# EAGLE design I2C_motor_driver (EAGLE 9.1.3)
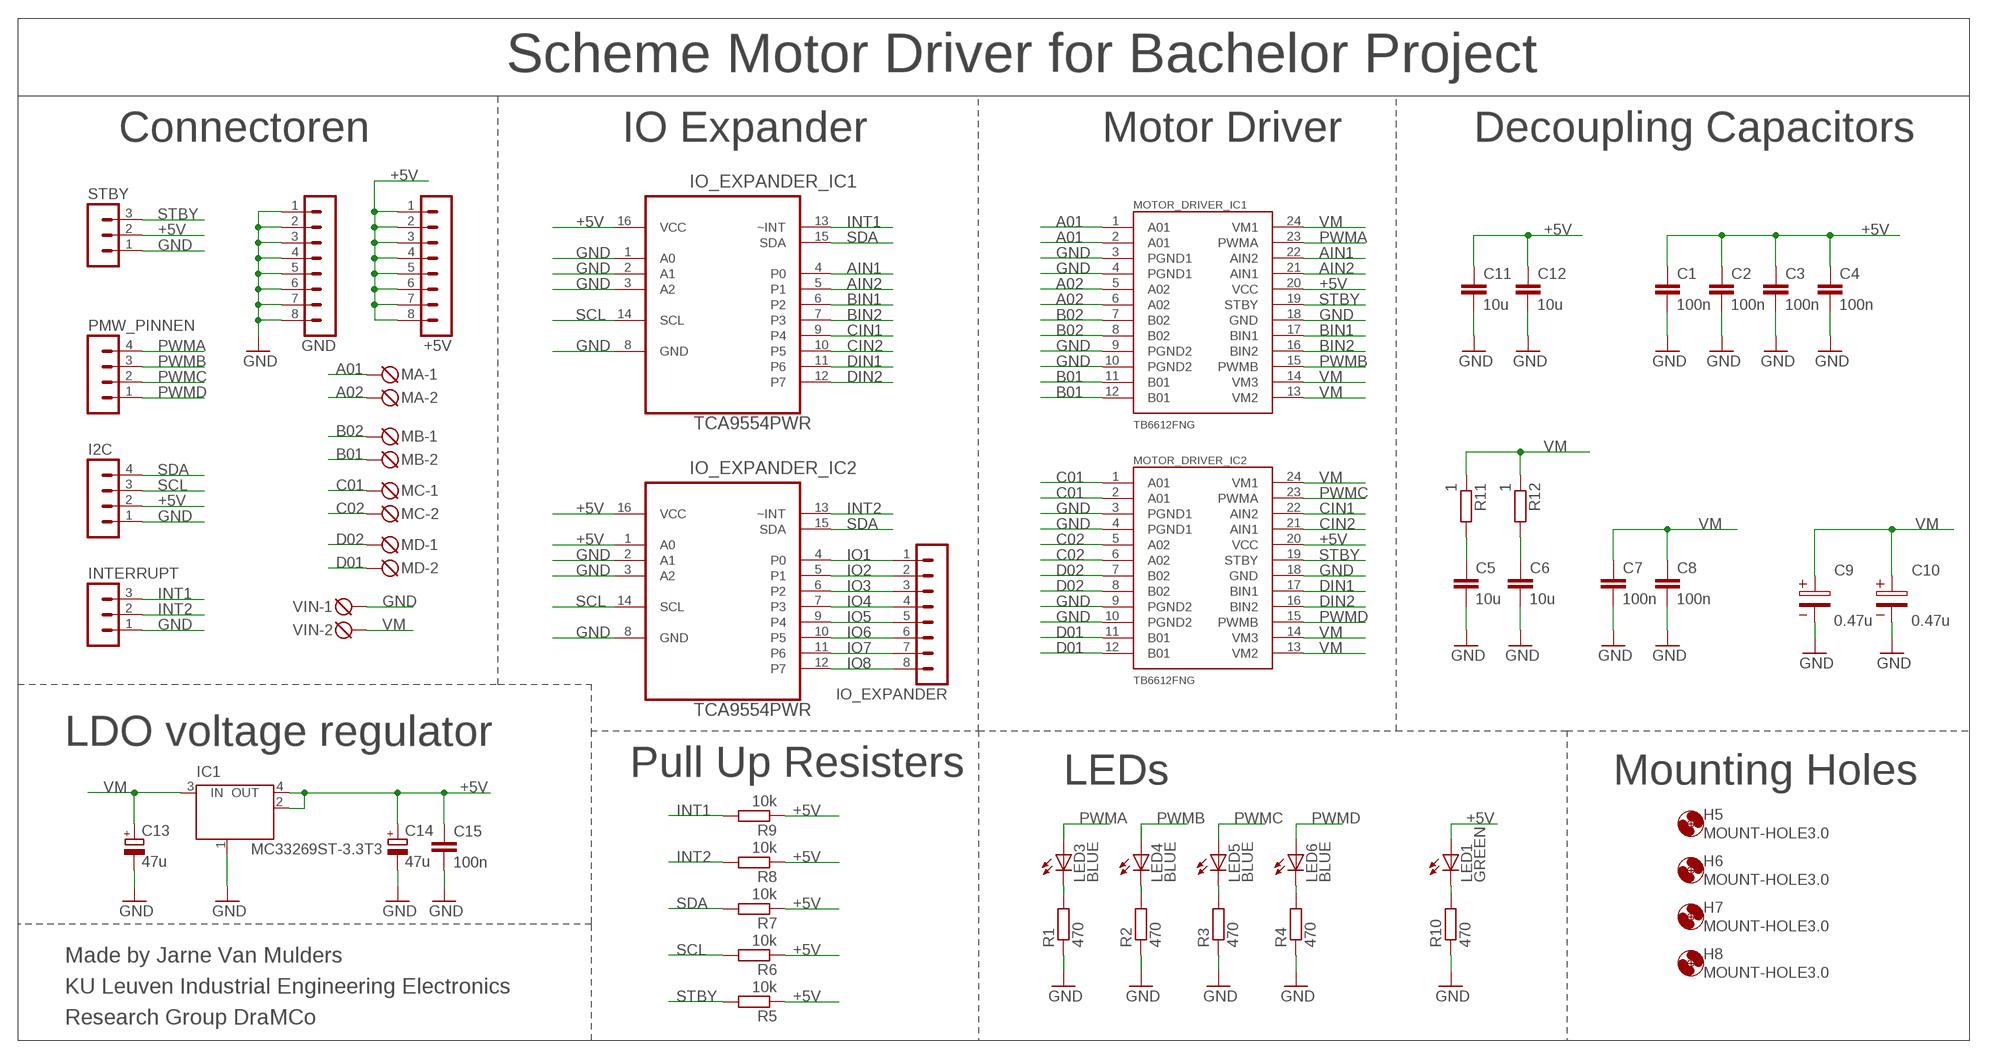
[diagram p0: schematic, sheet 1]

## Parts
+5V  MA08-1  [MA08-1]
C1  100n  C-EUC1206K  [C1206K]
C2  100n  C-EUC1206K  [C1206K]
C3  100n  C-EUC1206K  [C1206K]
C4  100n  C-EUC1206K  [C1206K]
C5  10u  C-EUC1206K  [C1206K]
C6  10u  C-EUC1206K  [C1206K]
C7  100n  C-EUC1206K  [C1206K]
C8  100n  C-EUC1206K  [C1206K]
C9  0.47u  WCAP-ASLI_4X5,5_865080740002  [2.6X1.6X1(BXCXA)]
C10  0.47u  WCAP-ASLI_4X5,5_865080740002  [2.6X1.6X1(BXCXA)]
C11  10u  C-EUC1206K  [C1206K]
C12  10u  C-EUC1206K  [C1206K]
C13  47u  CPOL-EUD  [PANASONIC_D]
C14  47u  CPOL-EUD  [PANASONIC_D]
C15  100n  C-EUC1206K  [C1206K]
GND  MA08-1  [MA08-1]
H5  MOUNT-HOLE3.0  [3,0]
H6  MOUNT-HOLE3.0  [3,0]
H7  MOUNT-HOLE3.0  [3,0]
H8  MOUNT-HOLE3.0  [3,0]
I2C  MA04-1  [MA04-1]
IC1  MC33269ST-3.3T3  [SOT223]
INTERRUPT  MA03-1  [MA03-1]
IO_EXPANDER  MA08-1  [MA08-1]
IO_EXPANDER_IC1  TCA9554PWR  [SOP65P640X120-16N]
IO_EXPANDER_IC2  TCA9554PWR  [SOP65P640X120-16N]
LED1  GREEN  LEDSML0805  [SML0805]
LED3  BLUE  LEDSML0805  [SML0805]
LED4  BLUE  LEDSML0805  [SML0805]
LED5  BLUE  LEDSML0805  [SML0805]
LED6  BLUE  LEDSML0805  [SML0805]
MA  DG3XX-02-5.0  [DG306-5.0-02P]
MB  DG3XX-02-5.0  [DG306-5.0-02P]
MC  DG3XX-02-5.0  [DG306-5.0-02P]
MD  DG3XX-02-5.0  [DG306-5.0-02P]
MOTOR_DRIVER_IC1  TB6612FNG  [SSOP24]
MOTOR_DRIVER_IC2  TB6612FNG  [SSOP24]
PMW_PINNEN  MA04-1  [MA04-1]
R1  470  R-EU_R1206  [R1206]
R2  470  R-EU_R1206  [R1206]
R3  470  R-EU_R1206  [R1206]
R4  470  R-EU_R1206  [R1206]
R5  10k  R-EU_R1206  [R1206]
R6  10k  R-EU_R1206  [R1206]
R7  10k  R-EU_R1206  [R1206]
R8  10k  R-EU_R1206  [R1206]
R9  10k  R-EU_R1206  [R1206]
R10  470  R-EU_R1206  [R1206]
R11  1  R-EU_R1206  [R1206]
R12  1  R-EU_R1206  [R1206]
STBY  MA03-1  [MA03-1]
VIN  DG3XX-02-5.0  [DG306-5.0-02P]

## Nets
+5V: +5V.1 +5V.2 +5V.3 +5V.4 +5V.5 +5V.6 +5V.7 +5V.8 C1.1 C2.1 C3.1 C4.1 C11.1 C12.1 C14.+ C15.1 I2C.2 IC1.2(OUT) IC1.4(OUT) IO_EXPANDER_IC1.16(VCC) IO_EXPANDER_IC2.1(A0) IO_EXPANDER_IC2.16(VCC) LED1.A MOTOR_DRIVER_IC1.20(VCC) MOTOR_DRIVER_IC2.20(VCC) R5.1 R6.1 R7.1 R8.1 R9.1 STBY.2
A01: MA.1 MOTOR_DRIVER_IC1.1(A01) MOTOR_DRIVER_IC1.2(A01)
A02: MA.2 MOTOR_DRIVER_IC1.5(A02) MOTOR_DRIVER_IC1.6(A02)
AIN1: IO_EXPANDER_IC1.4(P0) MOTOR_DRIVER_IC1.22(AIN2)
AIN2: IO_EXPANDER_IC1.5(P1) MOTOR_DRIVER_IC1.21(AIN1)
B01: MB.2 MOTOR_DRIVER_IC1.11(B01) MOTOR_DRIVER_IC1.12(B01)
B02: MB.1 MOTOR_DRIVER_IC1.7(B02) MOTOR_DRIVER_IC1.8(B02)
BIN1: IO_EXPANDER_IC1.6(P2) MOTOR_DRIVER_IC1.17(BIN1)
BIN2: IO_EXPANDER_IC1.7(P3) MOTOR_DRIVER_IC1.16(BIN2)
C01: MC.1 MOTOR_DRIVER_IC2.1(A01) MOTOR_DRIVER_IC2.2(A01)
C02: MC.2 MOTOR_DRIVER_IC2.5(A02) MOTOR_DRIVER_IC2.6(A02)
CIN1: IO_EXPANDER_IC1.9(P4) MOTOR_DRIVER_IC2.22(AIN2)
CIN2: IO_EXPANDER_IC1.10(P5) MOTOR_DRIVER_IC2.21(AIN1)
D01: MD.2 MOTOR_DRIVER_IC2.11(B01) MOTOR_DRIVER_IC2.12(B01)
D02: MD.1 MOTOR_DRIVER_IC2.7(B02) MOTOR_DRIVER_IC2.8(B02)
DIN1: IO_EXPANDER_IC1.11(P6) MOTOR_DRIVER_IC2.17(BIN1)
DIN2: IO_EXPANDER_IC1.12(P7) MOTOR_DRIVER_IC2.16(BIN2)
GND: C1.2 C2.2 C3.2 C4.2 C5.2 C6.2 C7.2 C8.2 C9.2 C10.2 C11.2 C12.2 C13.- C14.- C15.2 GND.1 GND.2 GND.3 GND.4 GND.5 GND.6 GND.7 GND.8 I2C.1 IC1.1(GND/ADJ) INTERRUPT.1 IO_EXPANDER_IC1.1(A0) IO_EXPANDER_IC1.2(A1) IO_EXPANDER_IC1.3(A2) IO_EXPANDER_IC1.8(GND) IO_EXPANDER_IC2.2(A1) IO_EXPANDER_IC2.3(A2) IO_EXPANDER_IC2.8(GND) MOTOR_DRIVER_IC1.3(PGND1) MOTOR_DRIVER_IC1.4(PGND1) MOTOR_DRIVER_IC1.9(PGND2) MOTOR_DRIVER_IC1.10(PGND2) MOTOR_DRIVER_IC1.18(GND) MOTOR_DRIVER_IC2.3(PGND1) MOTOR_DRIVER_IC2.4(PGND1) MOTOR_DRIVER_IC2.9(PGND2) MOTOR_DRIVER_IC2.10(PGND2) MOTOR_DRIVER_IC2.18(GND) R1.1 R2.1 R3.1 R4.1 R10.1 STBY.1 VIN.1
INT1: INTERRUPT.3 IO_EXPANDER_IC1.13(~INT) R9.2
INT2: INTERRUPT.2 IO_EXPANDER_IC2.13(~INT) R8.2
IO1: IO_EXPANDER.1 IO_EXPANDER_IC2.4(P0)
IO2: IO_EXPANDER.2 IO_EXPANDER_IC2.5(P1)
IO3: IO_EXPANDER.3 IO_EXPANDER_IC2.6(P2)
IO4: IO_EXPANDER.4 IO_EXPANDER_IC2.7(P3)
IO5: IO_EXPANDER.5 IO_EXPANDER_IC2.9(P4)
IO6: IO_EXPANDER.6 IO_EXPANDER_IC2.10(P5)
IO7: IO_EXPANDER.7 IO_EXPANDER_IC2.11(P6)
IO8: IO_EXPANDER.8 IO_EXPANDER_IC2.12(P7)
N$1: C5.1 R11.2
N$2: C6.1 R12.2
N$3: LED1.C R10.2
N$4: LED3.C R1.2
N$6: LED4.C R2.2
N$7: LED5.C R3.2
N$8: LED6.C R4.2
PWMA: LED3.A MOTOR_DRIVER_IC1.23(PWMA) PMW_PINNEN.4
PWMB: LED4.A MOTOR_DRIVER_IC1.15(PWMB) PMW_PINNEN.3
PWMC: LED5.A MOTOR_DRIVER_IC2.23(PWMA) PMW_PINNEN.2
PWMD: LED6.A MOTOR_DRIVER_IC2.15(PWMB) PMW_PINNEN.1
SCL: I2C.3 IO_EXPANDER_IC1.14(SCL) IO_EXPANDER_IC2.14(SCL) R6.2
SDA: I2C.4 IO_EXPANDER_IC1.15(SDA) IO_EXPANDER_IC2.15(SDA) R7.2
STBY: MOTOR_DRIVER_IC1.19(STBY) MOTOR_DRIVER_IC2.19(STBY) R5.2 STBY.3
VM: C7.1 C8.1 C9.1 C10.1 C13.+ IC1.3(IN) MOTOR_DRIVER_IC1.13(VM2) MOTOR_DRIVER_IC1.14(VM3) MOTOR_DRIVER_IC1.24(VM1) MOTOR_DRIVER_IC2.13(VM2) MOTOR_DRIVER_IC2.14(VM3) MOTOR_DRIVER_IC2.24(VM1) R11.1 R12.1 VIN.2

## Notes on the sheet
- Scheme Motor Driver for Bachelor Project
- Connectoren | IO Expander | Motor Driver | Decoupling Capacitors
- LDO voltage regulator
- Pull Up Resisters | LEDs | Mounting Holes
- Made by Jarne Van Mulders
- KU Leuven Industrial Engineering Electronics
- Research Group DraMCo

## Library data of the parts
+5V GND IO_EXPANDER = con-lstb:MA08-1: PIN HEADER; OC_FARNELL: unknown; OC_NEWARK: unknown
C1-C8 C11 C12 C15 = resistor:C-EU: CAPACITOR, European symbol
C9 C10 = Kondensatoren (rev17a):WCAP-ASLI: WCAP-ASLI Aluminum Electrolytic Capacitors Characteristics Aluminum Electrolytic Capacitor Recommended soldering: Reflow Operating temperature: -55 °C to +105 °C Low impedance product series Load life:2000 h @ +105 °C Package name and Variant abbreviation: Package: Package: B X C X A = length of the solder pad X width of the solder pad X pitch of the solder pad. <http://katalog.we-online.de/media/images/eisos/WCAP-ASLI_pf2.jpg> Details see: http://katalog.we-online.de/en/pbs/WCAP-ASLI Updated by: Yingchun,Shan Updated: 2017-03-16 2017 (C) Wurth Elektronik; WE-NUMBER: 865080740002/0,1uF
C13 C14 = rcl:CPOL-EU: POLARIZED CAPACITOR, European symbol
H5-H8 = holes:MOUNT-HOLE: MOUNTING HOLE with drill center marker
I2C PMW_PINNEN = con-lstb:MA04-1: PIN HEADER; OC_FARNELL: unknown; OC_NEWARK: unknown
IC1 = linear:MC33269ST*: Adjustable Output Low Dropout Voltage Regulator 800 mA Source: http://www.onsemi.com/pub/Collateral/MC33269-D.PDF
INTERRUPT STBY = con-lstb:MA03-1: PIN HEADER; OC_FARNELL: unknown; OC_NEWARK: unknown
IO_EXPANDER_IC1 IO_EXPANDER_IC2 = TCA9554PWR:TCA9554PWR: 8-BIT I2C AND SMBus I/O EXPANDER; AVAILABILITY: Unavailable; DESCRIPTION: Interface - I/O Expanders Remote 8-B I2C & SM Bus I/O Expander; MF: Texas Instruments; MP: TCA9554PWR; PACKAGE: TSSOP-16 Texas Instruments; PRICE: None
LED1 LED3-LED6 = led:LED: LED OSRAM: - CHIPLED LG R971, LG N971, LY N971, LG Q971, LY Q971, LO R971, LY R971 LH N974, LH R974 LS Q976, LO Q976, LY Q976 LO Q996 - Hyper CHIPLED LW Q18S LB Q993, LB Q99A, LB R99A - SideLED LS A670, LO A670, LY A670, LG A670, LP A670 LB A673, LV A673, LT A673, LW A673 LH A674 LY A675 LS A676, LA A676, LO A676, LY A676, LW A676 LS A679, LY A679, LG A679 - Hyper Micro SIDELED® LS Y876, LA Y876, LO Y876, LY Y876 LT Y87S - SmartLED LW L88C, LW L88S LB L89C, LB L89S, LG L890 LS L89K, LO L89K, LY L89K LS L896, LA L896, LO L896, LY L896 - TOPLED LS T670, LO T670, LY T670, LG T670, LP T670 LSG T670, LSP T670, LSY T670, LOP T670, LYG T670 LG T671, LOG T671, LSG T671 LB T673, LV T673, LT T673, LW T673 LH T674 LS T676, LA T676, LO T676, LY T676, LB T676, LH T676, LSB T676, LW T676 LB T67C, LV T67C, LT T67C, LS T67K, LO T67K, LY T67K, LW E67C LS E67B, LA E67B, LO E67B, LY E67B, LB E67C, LV E67C, LT E67C LW T67C LS T679, LY T679, LG T679 LS T770, LO T770, LY T770, LG T770, LP T770 LB T773, LV T773, LT T773, LW T773 LH T774 LS E675, LA E675, LY E675, LS T675 LS T776, LA T776, LO T776, LY T776, LB T776 LHGB T686 LT T68C, LB T68C - Hyper Mini TOPLED® LB M676 - Mini TOPLED Santana® LG M470 LS M47K, LO M47K, LY M47K Source: http://www.osram.convergy.de LUXEON: - LUMILED® LXK2-PW12-R00, LXK2-PW12-S00, LXK2-PW14-U00, LXK2-PW14-V00 LXK2-PM12-R00, LXK2-PM12-S00, LXK2-PM14-U00 LXK2-PE12-Q00, LXK2-PE12-R00, LXK2-PE12-S00, LXK2-PE14-T00, LXK2-PE14-U00 LXK2-PB12-K00, LXK2-PB12-L00, LXK2-PB12-M00, LXK2-PB14-N00, LXK2-PB14-P00, LXK2-PB14-Q00 LXK2-PR12-L00, LXK2-PR12-M00, LXK2-PR14-Q00, LXK2-PR14-R00 LXK2-PD12-Q00, LXK2-PD12-R00, LXK2-PD12-S00 LXK2-PH12-R00, LXK2-PH12-S00 LXK2-PL12-P00, LXK2-PL12-Q00, LXK2-PL12-R00 Source: www.luxeon.com KINGBRIGHT: KA-3528ASYC Source: www.kingbright.com
MA MB MC MD VIN = degson:DG3XX-02: DG350-3.5-02P DG306-5.0-02P
MOTOR_DRIVER_IC1 MOTOR_DRIVER_IC2 = SparkFun-IC-Special-Function:TB6612FNG: Toshiba 1A dual motor driver IC-09363; PROD_ID: IC-09363
R1-R12 = resistor:R-EU_: RESISTOR, European symbol

## Board
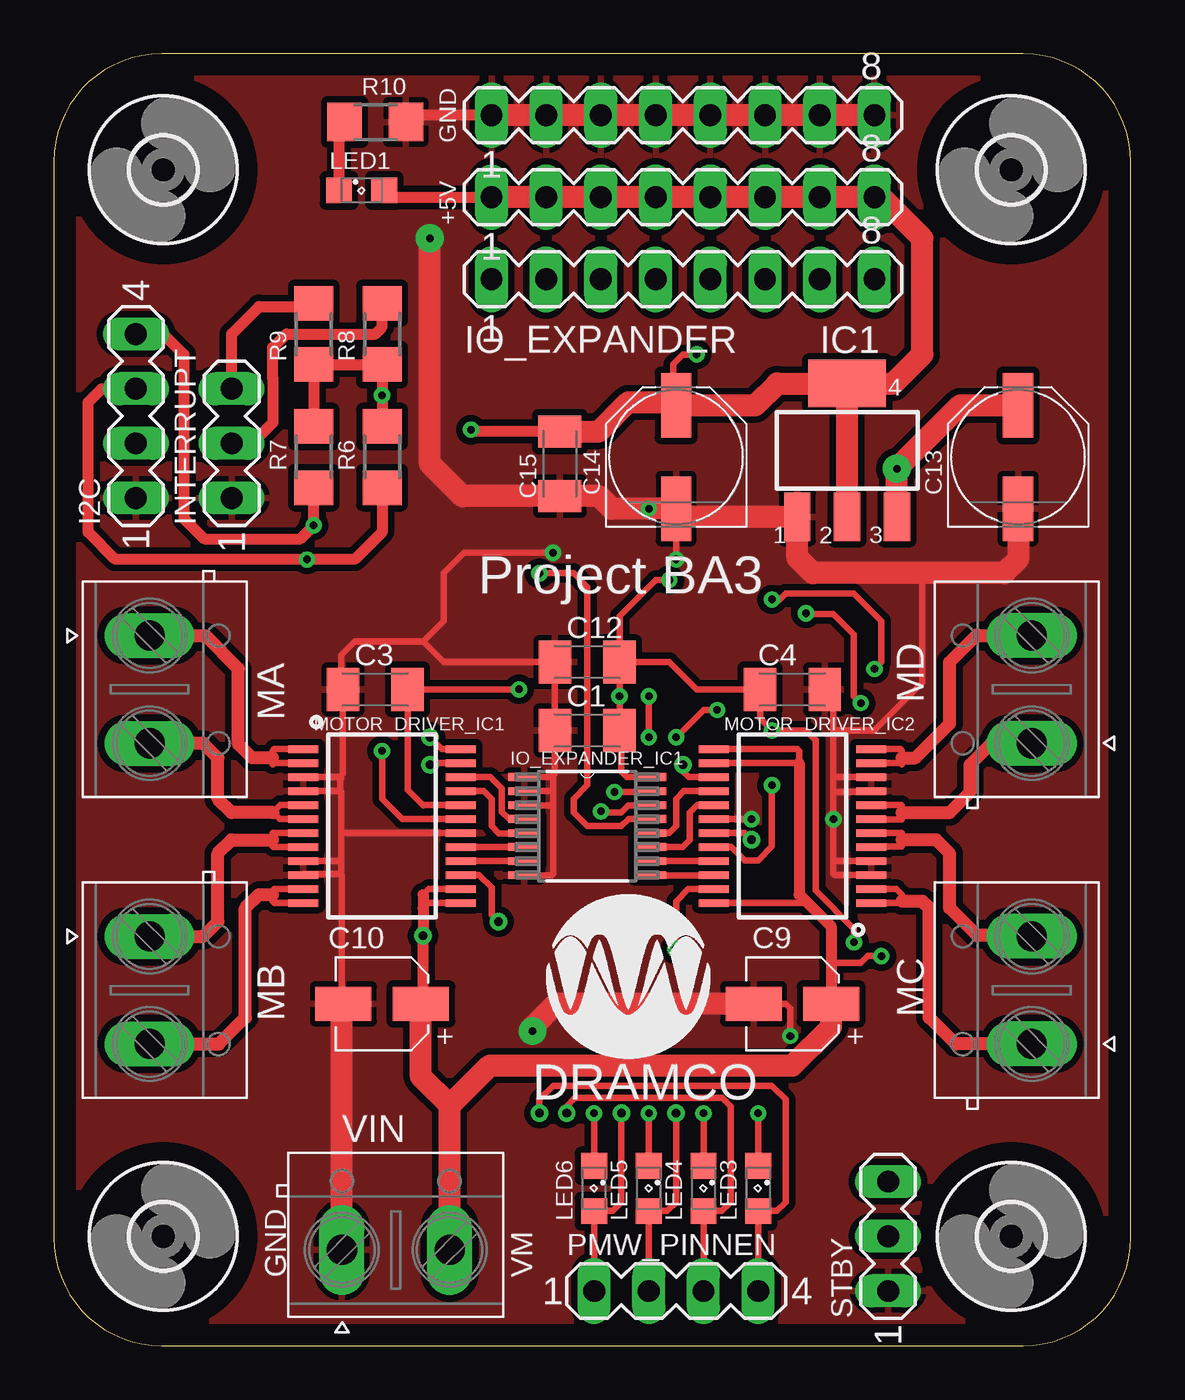
[diagram p1: board, top side]
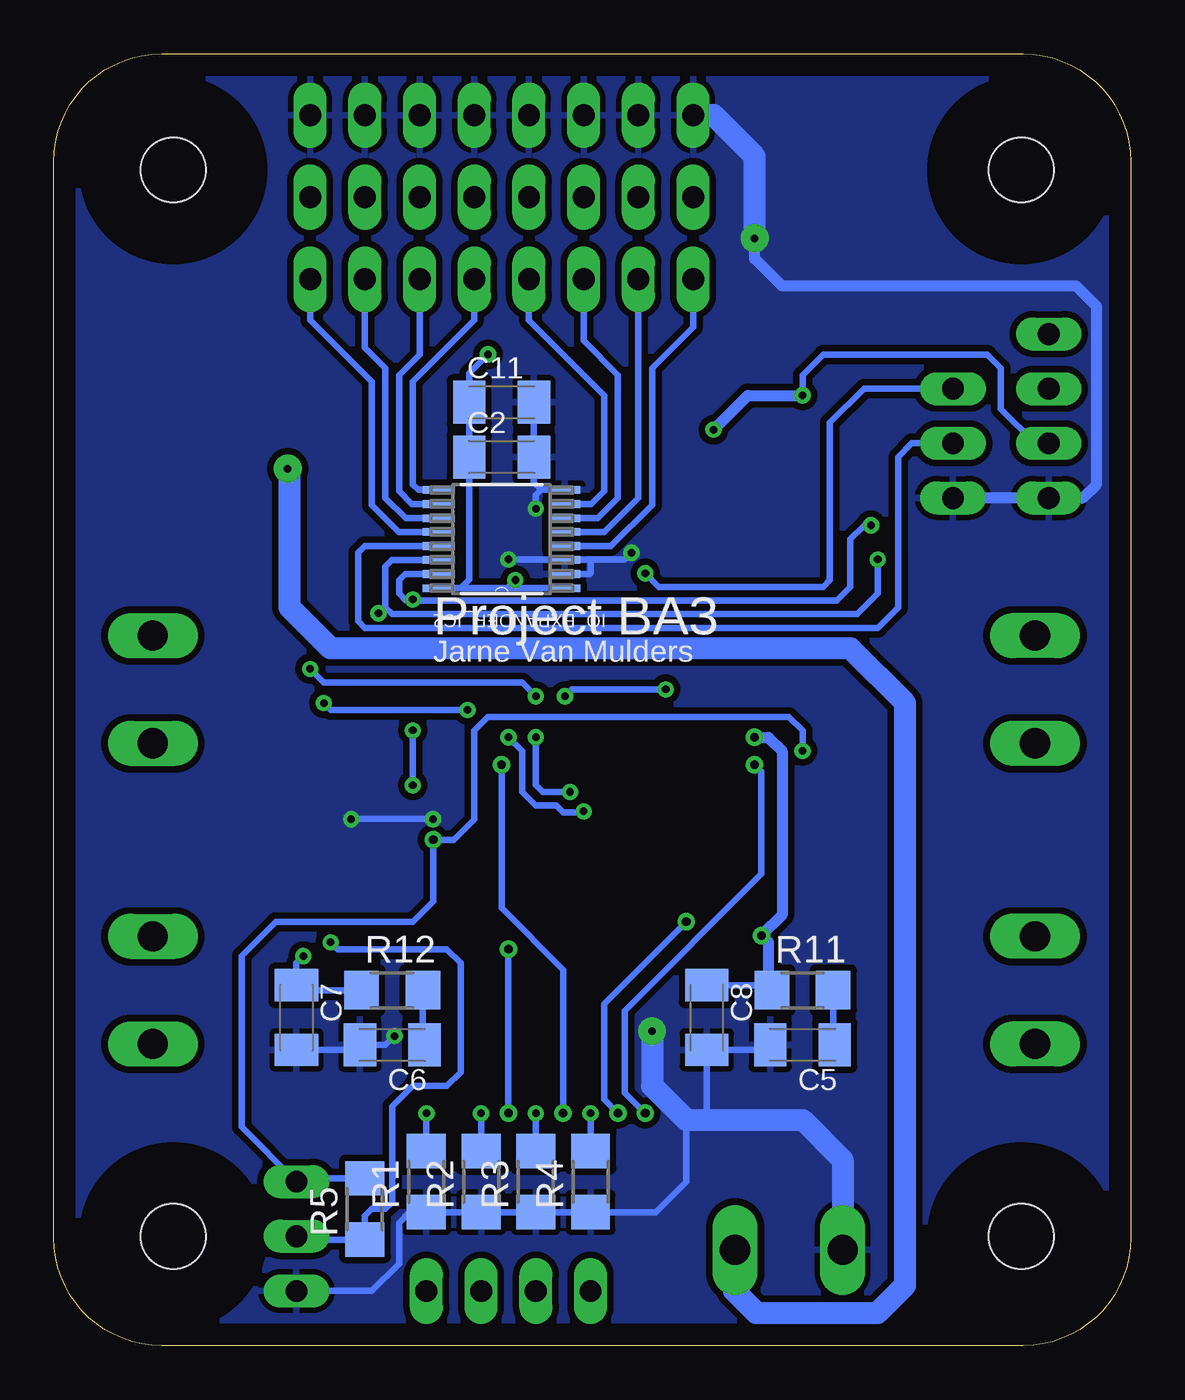
[diagram p2: board, bottom side, seen from below]

Size 50 x 60 mm. Coordinates in mm from the lower left corner, seen from the top.
Outline: 0,55 0,5 arc90 5,0 45,0 arc90 50,5 50,55 arc90 45,60 5,60 arc90 0,55
Copper layers (1*16): Top 0.035mm / dielectric 1.5mm / Bottom 0.035mm
Design rules "default": minimum track width 6mil, minimum drill 0.35mm, track to track 6mil, track to pad 6mil, pad to pad 6mil, via to via 6mil, smd to smd 6mil, copper to edge 40mil, drill to drill 6mil, minimum pad ring 10mil, minimum via ring 8mil, stop-mask expansion 4mil, vias tented up to drill 0mil, thermal gap 10mil

### Footprints (pad centres in the part's own frame; a part is rotated, then mirrored left to right if it is on the bottom)
MA08-1 = drill 1.016 long: 1 -8.89,0; 2 -6.35,0; 3 -3.81,0; 4 -1.27,0; 5 1.27,0; 6 3.81,0; 7 6.35,0; 8 8.89,0
C1206K = smd 1.5 x 2: 1 -1.5,0; 2 1.5,0
2.6X1.6X1(BXCXA) = smd 2.6 x 1.6: 1 1.8,0; 2 -1.8,0
PANASONIC_D = smd 3 x 1.4: + 2.4,0; - -2.4,0
3,0 = hole 3: 0,0
MA04-1 = drill 1.016 long: 1 -3.81,0; 2 -1.27,0; 3 1.27,0; 4 3.81,0
SOT223 = smd 1.219 x 2.235: 1 -2.311,-3.099; 2 0,-3.099; 3 2.311,-3.099 | smd 3.6 x 2.2: 4 0,3.099
MA03-1 = drill 1.016 long: 1 -2.54,0; 2 0,0; 3 2.54,0
SOP65P640X120-16N = smd 1.473 x 0.356: 1 -2.921,2.286; 2 -2.921,1.626; 3 -2.921,0.965; 4 -2.921,0.33; 5 -2.921,-0.33; 6 -2.921,-0.965; 7 -2.921,-1.626; 8 -2.921,-2.286; 9 2.921,-2.286; 10 2.921,-1.626; 11 2.921,-0.965; 12 2.921,-0.33; 13 2.921,0.33; 14 2.921,0.965; 15 2.921,1.626; 16 2.921,2.286
SML0805 = smd 1.2 x 1.2: A 1.05,0; C -1.05,0
DG306-5.0-02P = drill 1.4 long: 1 -2.5,0; 2 2.5,0
SSOP24 = smd 0.348 x 1.397: 1 -3.575,-3.656; 2 -2.925,-3.656; 3 -2.275,-3.656; 4 -1.625,-3.656; 5 -0.975,-3.656; 6 -0.325,-3.656; 7 0.325,-3.656; 8 0.975,-3.656; 9 1.625,-3.656; 10 2.275,-3.656; 11 2.925,-3.656; 12 3.575,-3.656; 13 3.575,3.656; 14 2.925,3.656; 15 2.275,3.656; 16 1.625,3.656; 17 0.975,3.656; 18 0.325,3.656; 19 -0.325,3.656; 20 -0.975,3.656; 21 -1.625,3.656; 22 -2.275,3.656; 23 -2.925,3.656; 24 -3.575,3.656
R1206 = smd 1.6 x 1.803: 1 -1.422,0; 2 1.422,0

### Placement (x,y rotation side)
+5V  29.21,53.34 0 top
C1  24.77,28.57 180 top
C2  29.21,41.27 0 bottom
C3  14.92,30.48 180 top
C4  34.29,30.48 0 top
C5  15.24,13.97 180 bottom
C6  34.29,13.97 180 bottom
C7  38.73,15.24 270 bottom
C8  19.68,15.24 270 bottom
C9  34.29,15.88 0 top
C10  15.24,15.88 0 top
C11  29.21,43.81 0 bottom
C12  24.77,31.75 180 top
C13  44.77,41.27 90 top
C14  28.89,41.27 90 top
C15  23.5,40.96 270 top
GND  29.21,57.15 0 top
H5  5.08,5.08 0 top
H6  44.45,54.61 0 top
H7  5.08,54.61 0 top
H8  44.45,5.08 0 top
I2C  3.81,43.18 90 top
IC1  36.83,41.59 0 top
INTERRUPT  8.26,41.91 90 top
IO_EXPANDER  29.21,49.53 0 top
IO_EXPANDER_IC1  24.77,24.13 0 top
IO_EXPANDER_IC2  29.21,37.47 180 bottom
LED1  14.29,53.66 0 top
LED3  32.7,7.3 270 top
LED4  30.16,7.3 270 top
LED5  27.62,7.3 270 top
LED6  25.08,7.3 270 top
MA  4.45,30.48 270 top
MB  4.45,16.51 270 top
MC  45.4,16.51 90 top
MD  45.4,30.48 90 top
MOTOR_DRIVER_IC1  15.24,24.13 270 top
MOTOR_DRIVER_IC2  34.29,24.13 90 top
PMW_PINNEN  28.89,2.54 0 top
R1  32.7,7.62 90 bottom
R2  30.16,7.62 90 bottom
R3  27.62,7.62 90 bottom
R4  25.08,7.62 90 bottom
R5  35.56,6.35 90 bottom
R6  15.24,41.27 270 top
R7  12.06,41.27 270 top
R8  15.24,46.99 90 top
R9  12.06,46.99 90 top
R10  14.92,56.83 180 top
R11  15.24,16.51 0 bottom
R12  34.29,16.51 0 bottom
STBY  38.73,5.08 90 top
VIN  15.88,4.45 0 top

### Tracks (layer width: path | path; a pad name or v marks a point on that pad's centre or on a via)
+5V  (via drill 0.35, 0.35 pad 0.75)
  Top 0.305: MOTOR_DRIVER_IC1.20 17.17,25.11 17.14,25.08 16.42,25.8 C3.1 v21.59,30.48 | IO_EXPANDER_IC1.16 26.61,26.42 26.35,26.67 26.35,28.49 C1.1 v26.27,30.16 C12.1 | MOTOR_DRIVER_IC2.20 31.45,23.16 32.07,22.54 32.7,22.54 33.34,23.18 v33.34,26.04 | C12.1 28.57,31.75 29.84,30.48 C4.1 32.79,29.12 v33.34,28.57 34.92,28.57 35.34,28.16 35.35,28.16 35.38,28.13 35.38,21.13 37.15,19.37 v37.15,18.73 | v29.84,46.04 29.21,46.04 28.75,45.58 28.75,43.81 | C12.1 26.27,33.88 27.94,35.56 v28.57,35.56
  Top 0.508: R7.1 R9.1 R8.1 v15.24,44.13 R6.1 | LED1.A 15.65,53.34 +5V.1 | C15.1 19.45,42.46 v19.37,42.55
  Top 1.016: IC1.2 IC1.4 | IC1.4 33.58,44.69 32.56,43.67 C14.+ 28.75,43.81 26.67,43.81 25.31,42.46 C15.1 | +5V.1 +5V.2 +5V.3 +5V.4 +5V.5 +5V.6 +5V.7 +5V.8 38.42,53.34 40.32,51.44 40.32,46.04 38.98,44.69 IC1.4
  Bottom 0.305: STBY.2 38.58,4.93 R5.1 35.56,6.03 35.24,6.35 34.61,6.35 34.29,6.67 34.29,11.11 33.34,12.06 31.75,12.06 31.11,12.7 31.11,17.78 31.75,18.41 36.83,18.41 v37.15,18.73 | v33.34,26.04 v33.34,28.57 | IO_EXPANDER_IC2.1 28.89,35.18 | 28.89,35.18 31.11,35.18 | 31.11,35.18 IO_EXPANDER_IC2.16 | 31.11,35.18 30.71,35.58 C2.1 C11.1 30.71,45.17 v29.84,46.04 | v21.59,30.48 25.95,30.48 v26.27,30.16 | I2C.2 4.45,41.91 6.03,43.5 6.03,45.4 6.67,46.04 14.29,46.04 15.24,45.09 v15.24,44.13 | v28.57,35.56 28.89,35.24 28.89,35.18
  Bottom 0.508: v19.37,42.55 17.78,44.13 v15.24,44.13
A01
  Top 0.305: MOTOR_DRIVER_IC1.1 10.24,27.7 10.16,27.62 10.16,27.3 10.16,26.99 10.23,27.05 MOTOR_DRIVER_IC1.2
  Top 0.61: MA.1 7.03,32.98 8.57,31.43 8.57,27.94 9.21,27.3 10.16,27.3
A02
  Top 0.305: MOTOR_DRIVER_IC1.5 10.52,25.11 10.18,24.77 10.49,24.45 MOTOR_DRIVER_IC1.6
  Top 0.61: MA.2 6.95,27.98 7.62,27.3 7.62,25.4 8.26,24.77 10.18,24.77
AIN1
  Top 0.305: IO_EXPANDER_IC1.4 21.13,24.46 20.8,24.79 20.8,25.87 20.27,26.41 MOTOR_DRIVER_IC1.22
AIN2
  Top 0.305: MOTOR_DRIVER_IC1.21 19.96,25.75 20.32,25.4 20.32,24.13 20.65,23.8 IO_EXPANDER_IC1.5
B01
  Top 0.305: MOTOR_DRIVER_IC1.11 10.23,21.2 9.98,20.95 9.84,20.95 | MOTOR_DRIVER_IC1.12 10.24,20.55 10.16,20.64 10.16,20.95
  Top 0.61: MB.2 7.66,14.01 8.89,15.24 8.89,20.32 9.53,20.95 9.84,20.95 10.16,20.95
B02
  Top 0.305: MOTOR_DRIVER_IC1.7 11.58,23.81 10.16,23.81 10.16,23.5 10.16,23.18 10.18,23.16 MOTOR_DRIVER_IC1.8
  Top 0.61: MB.1 6.95,19.01 7.62,19.68 7.62,22.86 8.26,23.5 10.16,23.5
BIN1
  Top 0.305: MOTOR_DRIVER_IC1.17 arc-45 18.92,23.16 IO_EXPANDER_IC1.6
BIN2
  Top 0.305: MOTOR_DRIVER_IC1.16 IO_EXPANDER_IC1.7 arc-45 IO_EXPANDER_IC1.7
C01
  Top 0.305: MOTOR_DRIVER_IC2.2 39.12,21.2 39.37,20.95 39.37,20.64 39.29,20.55 MOTOR_DRIVER_IC2.1
  Top 0.61: MC.1 41.87,14.01 40.64,15.24 40.64,20.32 40.32,20.64 39.37,20.64
C02
  Top 0.305: MOTOR_DRIVER_IC2.5 37.97,23.18 39.37,23.18 39.37,23.5 39.37,23.81 39.36,23.8 MOTOR_DRIVER_IC2.6
  Top 0.61: MC.2 45.36,19.05 42.86,19.05 41.59,20.32 41.59,22.86 40.96,23.5 39.37,23.5
CIN1
  Top 0.305: IO_EXPANDER_IC1.9 30.62,21.84 MOTOR_DRIVER_IC2.22
CIN2
  Top 0.305: IO_EXPANDER_IC1.10 MOTOR_DRIVER_IC2.21
D01
  Top 0.305: MOTOR_DRIVER_IC2.12 39.29,27.7 39.37,27.62 39.37,27.3 39.37,26.99 39.3,27.05 MOTOR_DRIVER_IC2.11
  Top 0.61: 39.37,27.3 40.01,27.3 41.59,28.89 41.59,31.75 42.86,33.02 42.9,32.98 MD.2
D02
  Top 0.305: MOTOR_DRIVER_IC2.8 39.35,25.11 39.37,25.08 39.37,24.77 39.37,24.45 MOTOR_DRIVER_IC2.7
  Top 0.61: 39.37,24.77 41.59,24.77 42.55,25.72 42.55,26.99 43.5,27.94 45.36,27.94 MD.1
DIN1
  Top 0.305: IO_EXPANDER_IC1.11 29.2,23.16 29.53,23.5 29.53,24.77 29.87,25.11 MOTOR_DRIVER_IC2.17
DIN2
  Top 0.305: IO_EXPANDER_IC1.12 27.7,23.81 28.57,23.81 28.89,24.13 28.89,25.4 29.25,25.75 MOTOR_DRIVER_IC2.16
GND  (via drill 0.35, 0.35 pad 0.75, 0.35 pad 1.27, 0.35 pad 1.3)
  Top 0.305: IO_EXPANDER_IC1.1 23.11,26.42 | 23.11,26.42 23.18,26.35 23.18,25.72 | 23.18,25.72 23.18,25.08 | 23.18,25.08 21.86,25.08 IO_EXPANDER_IC1.3 | IO_EXPANDER_IC1.2 23.14,25.76 23.18,25.72 | IO_EXPANDER_IC1.8 23.11,21.84 23.18,21.91 23.18,25.08 | MOTOR_DRIVER_IC1.4 13.3,25.75 | 13.3,25.75 13.34,25.72 13.34,23.81 | 13.3,22.5 13.34,22.54 13.34,23.81 | 13.3,22.5 MOTOR_DRIVER_IC1.9 | MOTOR_DRIVER_IC1.10 11.64,21.91 13.34,21.91 | 13.34,21.91 13.34,22.47 13.3,22.5 | MOTOR_DRIVER_IC1.3 13.28,26.41 | 13.28,26.41 13.34,26.35 13.3,26.32 13.3,25.75 | MOTOR_DRIVER_IC2.10 36.25,26.41 | 36.25,26.41 36.2,26.35 36.2,25.72 | MOTOR_DRIVER_IC2.4 36.23,22.5 36.2,22.54 | 36.2,22.54 36.2,21.91 36.25,21.86 MOTOR_DRIVER_IC2.3 | 36.2,25.72 v36.2,24.45 36.2,22.54 | 13.28,26.41 13.42,26.55 C3.2 13.34,30.57 13.34,32.07 13.97,32.7 17.14,32.7 | 23.11,26.42 23.27,26.57 C1.2 C12.2 18.1,31.75 17.14,32.7 | MOTOR_DRIVER_IC2.9 37.91,25.72 36.2,25.72 | 13.34,21.91 13.38,21.87 13.38,15.81 | 36.25,26.41 36.2,26.46 36.2,28.57 | C4.2 36.2,30.07 36.2,28.57 | MOTOR_DRIVER_IC2.18 32.38,24.45 v32.38,24.45 v32.39,24.45 | MOTOR_DRIVER_IC1.18 13.34,23.8 13.34,23.81 | 17.14,32.7 18.1,33.66 18.1,35.88 19.05,36.83 v23.18,36.83 | 40.32,35.88 40.32,30.8 38.1,28.57 36.2,28.57 | v28.89,36.51 28.89,38.11 29.27,38.49 | v34.19,14.39 34.19,15.66 33.97,15.88 C9.2
  Top 0.508: GND.1 16.66,57.15 R10.1
  Top 1.016: VIN.1 13.38,15.81 C10.2 | C9.2 23.28,15.88 22.23,14.82 v22.23,14.61 | C13.- 44.77,36.51 44.13,35.88 40.32,35.88 35.24,35.88 34.52,36.6 IC1.1 29.27,38.49 C14.- v27.62,38.88 25.89,38.88 25.31,39.46 C15.2 18.96,39.46 17.46,40.96 v17.46,51.44 | GND.8 GND.7 GND.6 GND.5 GND.4 GND.3 GND.2 GND.1
  Bottom 0.305: C5.2 16.97,13.74 C8.2 19.68,10.48 | C7.2 36.02,13.74 C6.2 34.61,13.97 v34.19,14.39 | 20.64,10.48 20.64,7.62 22.06,6.2 R4.1 R3.1 R2.1 R1.1 33.49,6.2 33.97,5.71 33.97,3.81 35.24,2.54 STBY.1 | 25.08,36.51 26.28,36.51 IO_EXPANDER_IC2.3 26.3,36.51 v28.89,36.51 | 25.08,36.51 25.08,35.88 25.12,35.84 IO_EXPANDER_IC2.2 | IO_EXPANDER_IC2.8 27.37,39.75 | 27.37,39.75 27.71,40.09 C2.2 C11.2 | 27.37,39.75 27.62,39.5 v27.62,38.88 | v32.39,24.45 36.19,24.45 v36.2,24.45 | v23.18,36.83 23.5,36.51 25.08,36.51
  Bottom 0.508: INTERRUPT.1 I2C.1 2.22,39.37 1.59,40.01 1.59,48.26 2.54,49.21 16.19,49.21 17.46,50.48 v17.46,51.44
  Bottom 1.016: v22.23,14.61 22.23,12.06 20.64,10.48 19.68,10.48 15.24,10.48 13.38,8.61 VIN.1 | v17.46,51.44 17.46,55.24 19.37,57.15 GND.1
  pour Top (isolate 0.305): -0.32,60.33 52.39,60.33 52.39,-0.64 -1.59,-0.64 -1.59,60.33 -0.64,60.33
  pour Bottom (isolate 0.305): -0.64,60.96 51.75,60.96 51.75,0.32 51.75,-0.32 -0.64,-0.32
INT1  (via drill 0.35 pad 0.75)
  Top 0.305: v22.54,35.88 24.13,35.88 24.77,35.24 24.77,26.04 24.13,25.4 24.13,24.77 24.77,24.13 26.35,24.13 26.68,24.46 IO_EXPANDER_IC1.13
  Top 0.508: INTERRUPT.3 8.26,46.99 9.53,48.26 11.91,48.26 R9.2
  Bottom 0.305: INTERRUPT.3 12.38,44.45 13.97,42.86 13.97,35.56 14.29,35.24 21.91,35.24 v22.54,35.88
INT2
  Top 0.508: INTERRUPT.2 9.21,41.91 10.19,42.89 10.19,44.93 10.16,44.96 10.16,46.35 10.79,46.99 14.92,46.99 15.24,47.31 R8.2
  Bottom 0.305: IO_EXPANDER_IC2.13 35.57,37.13 35.88,36.83 35.88,33.66 35.56,33.34 11.75,33.34 10.79,34.29 10.79,41.27 10.16,41.91 INTERRUPT.2
IO1
  Bottom 0.305: IO_EXPANDER_IC2.4 24.14,37.13 22.23,39.05 22.23,45.4 20.32,47.31 IO_EXPANDER.1
IO2
  Bottom 0.305: IO_EXPANDER_IC2.5 24.43,37.8 22.86,39.37 IO_EXPANDER.2
IO3
  Bottom 0.305: IO_EXPANDER_IC2.6 24.75,38.43 23.81,39.37 23.81,45.09 25.4,46.67 IO_EXPANDER.3
IO4
  Bottom 0.305: IO_EXPANDER_IC2.7 25.04,39.09 24.45,39.69 24.45,44.13 27.94,47.62 IO_EXPANDER.4
IO5
  Bottom 0.305: IO_EXPANDER_IC2.9 33.08,39.75 33.34,40.01 33.34,44.77 30.48,47.62 IO_EXPANDER.5
IO6
  Bottom 0.305: IO_EXPANDER_IC2.10 33.38,39.09 33.97,39.69 33.97,45.09 33.02,46.04 IO_EXPANDER.6
IO7
  Bottom 0.305: IO_EXPANDER_IC2.11 33.67,38.43 34.61,39.37 34.61,45.4 35.56,46.35 IO_EXPANDER.7
IO8
  Bottom 0.305: IO_EXPANDER_IC2.12 33.98,37.8 35.24,39.05 35.24,44.77 38.1,47.62 IO_EXPANDER.8
N$1
  Bottom 0.305: R11.2 13.82,14.05 C5.1
N$2
  Bottom 0.305: C6.1 32.87,14.05 R12.2
N$3
  Top 0.508: R10.2 13.24,56.57 LED1.C
N$4  (via drill 0.35)
  Top 0.305: v32.7,10.79 LED3.C
  Bottom 0.305: R1.2 v32.7,10.79
N$6  (via drill 0.35)
  Top 0.305: v30.16,10.79 LED4.C
  Bottom 0.305: R2.2 v30.16,10.79
N$7  (via drill 0.35)
  Top 0.305: LED5.C v27.62,10.79
  Bottom 0.305: v27.62,10.79 R3.2
N$8  (via drill 0.35)
  Top 0.305: v25.08,10.79 LED6.C
  Bottom 0.305: R4.2 v25.08,10.79
PWMA  (via drill 0.4 pad 0.8)
  Top 0.305: PMW_PINNEN.4 LED3.A 33.56,6.25 33.97,6.67 33.97,11.43 33.34,12.06 23.18,12.06 22.54,11.43 v22.54,10.79 | MOTOR_DRIVER_IC1.23 17.53,27.05 v17.46,26.99
  Bottom 0.305: v22.54,10.79 23.5,11.75 23.5,15.56 17.14,21.91 17.14,26.67 v17.46,26.99
PWMB  (via drill 0.4 pad 0.8)
  Top 0.305: PMW_PINNEN.3 LED4.A 31.02,6.25 31.43,6.67 31.43,11.11 31.04,11.5 24.19,11.5 23.81,11.13 v23.81,10.79 | v20.64,19.68 20.32,20 20.32,21.27 19.74,21.86 MOTOR_DRIVER_IC1.15
  Bottom 0.305: v20.64,19.68 24.45,15.88 24.45,11.43 v23.81,10.79
PWMC  (via drill 0.4 pad 0.8)
  Top 0.305: PMW_PINNEN.2 LED5.A 28.48,6.25 28.89,6.67 v28.89,10.79 | v28.89,18.41 28.89,20.64 29.46,21.2 MOTOR_DRIVER_IC2.23
  Bottom 0.305: v28.89,10.79 v28.89,18.41
PWMD  (via drill 0.4 pad 0.8)
  Top 0.305: PMW_PINNEN.1 LED6.A 25.94,6.25 26.35,6.67 v26.35,10.79 | v29.21,26.99 29.21,26.67 29.48,26.41 MOTOR_DRIVER_IC2.15
  Bottom 0.305: v26.35,10.79 26.35,17.46 29.21,20.32 v29.21,26.99
SCL  (via drill 0.35, 0.35 pad 0.75)
  Top 0.305: IO_EXPANDER_IC1.14 26.67,25.09 26.34,24.77 25.4,24.77 v25.4,24.81 | v28.89,28.26 30.16,29.53 v30.8,29.53 | v37.47,29.84 37.15,30.16 37.15,33.02 36.2,33.97 34.92,33.97 v34.92,34.02
  Top 0.508: R6.2 15.24,37.78 13.97,36.51 v11.75,36.51 2.86,36.51 1.59,37.78 1.59,43.81 2.22,44.45 I2C.3
  Bottom 0.305: IO_EXPANDER_IC2.14 34.3,36.5 34.61,36.2 34.61,34.29 | 34.61,34.29 34.29,33.97 12.7,33.97 11.75,34.92 v11.75,36.51 | v25.4,24.81 25.67,24.81 25.72,24.77 26.35,24.77 26.67,25.08 27.62,25.08 28.26,25.72 28.26,27.62 v28.89,28.26 | v30.8,29.53 37.15,29.53 v37.47,29.84 | 34.61,34.29 34.66,34.29 v34.92,34.02
SDA  (via drill 0.35, 0.35 pad 0.75)
  Top 0.305: IO_EXPANDER_IC1.15 27.65,25.72 v26.04,25.72 | v27.62,28.26 v27.62,30.16 | v33.34,34.66 33.7,34.66 33.97,34.92 37.15,34.92 38.42,33.66 38.42,31.75 v38.1,31.43
  Top 0.508: I2C.4 5.08,46.99 6.03,46.04 6.03,38.42 6.99,37.47 11.43,37.47 v12.06,38.1 R7.2
  Bottom 0.305: IO_EXPANDER_IC2.15 33.69,35.84 33.97,35.56 33.97,34.92 33.66,34.61 33.34,34.61 | v12.06,38.1 12.38,38.1 13.02,37.47 13.02,35.24 13.65,34.61 33.34,34.61 | v26.04,25.72 27.3,25.72 27.62,26.04 v27.62,28.26 | v27.62,30.16 28.26,30.8 37.47,30.8 v38.1,31.43 | v33.34,34.66 33.34,34.61
STBY  (via drill 0.35 pad 0.75, 0.4 pad 0.8)
  Top 0.305: MOTOR_DRIVER_IC2.19 32.08,23.8 v32.38,23.5 | MOTOR_DRIVER_IC1.19 16.18,24.45 15.24,25.4 v15.24,27.62
  Bottom 0.305: R5.2 38.58,7.77 STBY.3 41.27,10.16 41.27,18.1 39.69,19.68 33.34,19.68 32.38,20.64 v32.38,23.5 31.43,23.5 30.48,24.45 30.48,28.57 29.84,29.21 15.88,29.21 15.24,28.57 v15.24,27.62
VM  (via drill 0.35, 0.35 pad 1.3, 0.4 pad 0.8)
  Top 0.305: MOTOR_DRIVER_IC1.14 17.39,21.2 17.14,20.95 | MOTOR_DRIVER_IC1.13 17.38,20.55 17.14,20.32 | C10.1 17.14,15.98 | MOTOR_DRIVER_IC2.13 34.52,27.7 34.54,27.69 34.61,27.62 34.61,27.05 MOTOR_DRIVER_IC2.14 | MOTOR_DRIVER_IC2.24 34.92,20.55 34.92,20.64 | MOTOR_DRIVER_IC1.24 18.02,27.7 v17.46,28.26 | v38.42,18.1 37.78,18.1 37.47,17.78 36.09,17.78
  Top 0.508: 17.14,20.95 17.14,20.32 v17.14,19.05 17.14,15.98 | 34.61,27.05 34.61,20.95 34.92,20.64 36.09,19.47 36.09,17.78 C9.1
  Top 1.016: VIN.2 18.38,11.15 | C10.1 17.04,12.49 18.38,11.15 | 18.38,11.15 20.24,13.02 34.29,13.02 36.09,14.82 C9.1 | IC1.3 v39.14,40.73 42.09,43.67 C13.+
  Bottom 0.305: C8.1 16.89,16.74 16.83,16.68 R11.1 | R12.1 38.51,16.51 C7.1 38.73,17.78 v38.42,18.1
  Bottom 0.508: 16.83,16.68 16.83,18.73 v17.14,19.05 16.19,20 16.19,27.62 16.83,28.26 v17.46,28.26
  Bottom 1.016: VIN.2 18.41,4.41 18.41,2.54 17.4,1.52 11.75,1.52 10.48,2.79 10.48,29.84 13.02,32.38 37.15,32.38 39.05,34.29 39.05,40.64 v39.14,40.73

### Text on the board
tPlace: Project BA3 | GND | VM
bPlace: Project BA3 | Jarne Van Mulders
tNames: DRAMCO